# EasyEDA Pro project M484SID.eprj

# Schematic M484SID.LCSch
Create Date: 2023-01-18; Page Name: Core; Project Name: M484SID; Schematic Name: M484SID.LCSch; Update Date: 2023-08-13; Company: 嘉立创EDA; Page Size: A4; Version: V1.0
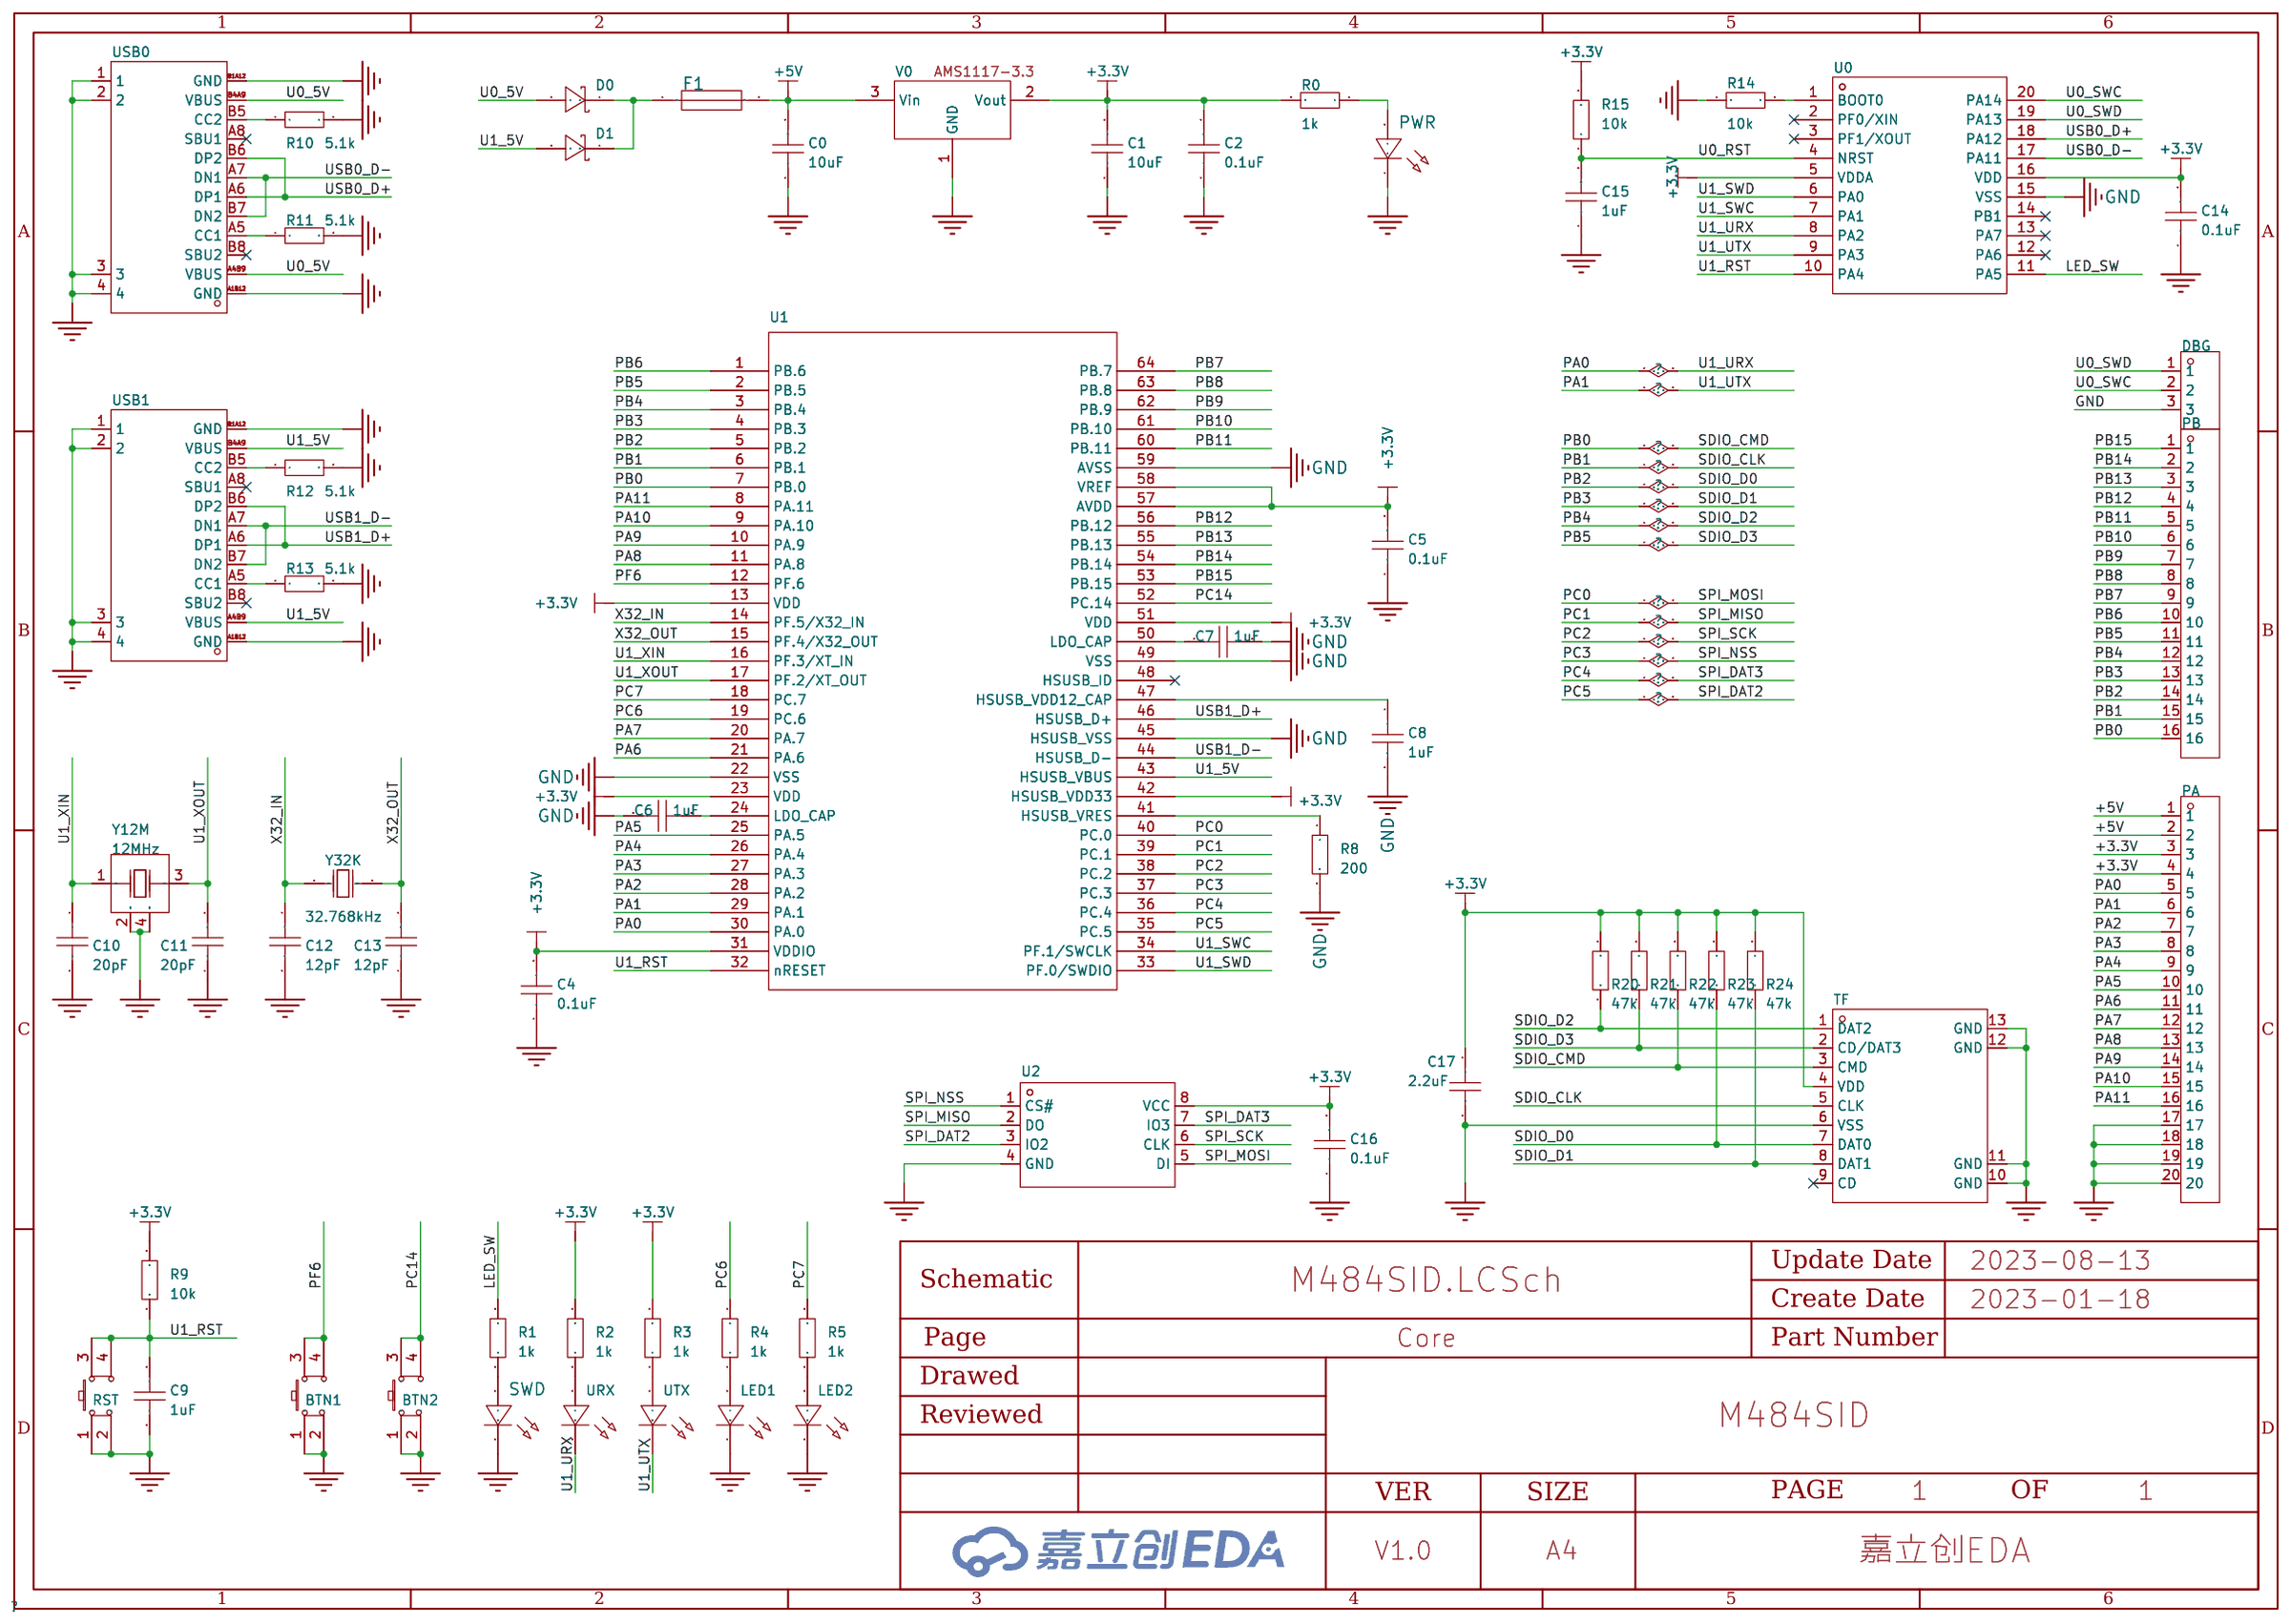
[diagram p0: schematic sheet]

## Parts
BTN1  PTS815SJK250SMTRLFS  [SW-SMD_4P-L4.2-W3.3-P2.15-LS5.1]
BTN2  PTS815SJK250SMTRLFS  [SW-SMD_4P-L4.2-W3.3-P2.15-LS5.1]
C0  10uF  [C0603]
C1  10uF  [C0603]
C2  0.1uF  [C0603]
C4  0.1uF  [C0603]
C5  0.1uF  [C0603]
C6  1uF  [C0603]
C7  1uF  [C0603]
C8  1uF  [C0603]
C9  1uF  [C0603]
C10  20pF  [C0603]
C11  20pF  [C0603]
C12  12pF  [C0603]
C13  12pF  [C0603]
C14  0.1uF  [C0603]
C15  1uF  [C0603]
C16  0.1uF  [C0603]
C17  2.2uF  [C0603]
D0  1N5818W  [SOD-123FL_L2.8-W1.8-LS3.7-RD]
D1  1N5818W  [SOD-123FL_L2.8-W1.8-LS3.7-RD]
DBG  -  [HDR-TH_3P-P2.54-V-M]
F1  JK-nSMD050-30  [F1206]
LED1  -  [LED0603-RD_BLUE]
LED2  -  [LED0603-RD_BLUE]
PA  -  [HDR-TH_20P-P2.54-V-M-1]
PB  -  [HDR-TH_16P-P2.54-V-M]
PWR  -  [LED0603-RD_BLUE]
R0  1k  [R0603]
R1  1k  [R0603]
R2  1k  [R0603]
R3  1k  [R0603]
R4  1k  [R0603]
R5  1k  [R0603]
R8  200  [R0603]
R9  10k  [R0603]
R10  5.1k  [R0603]
R11  5.1k  [R0603]
R12  5.1k  [R0603]
R13  5.1k  [R0603]
R14  10k  [R0603]
R15  10k  [R0603]
R20  47k  [R0603]
R21  47k  [R0603]
R22  47k  [R0603]
R23  47k  [R0603]
R24  47k  [R0603]
RST  PTS815SJK250SMTRLFS  [SW-SMD_4P-L4.2-W3.3-P2.15-LS5.1]
SWD  -  [LED0603-RD_BLUE]
TF  TF-01  [TF-SMD_TF-02]
U0  -  [TSSOP-20_L6.5-W4.4-P0.65-LS6.4-BL]
U1  *  [LQFP-64_7X7X04P]
U2  W25Q128JVSIQ  [SOIC-8_L5.3-W5.3-P1.27-LS8.0-BL]
URX  -  [LED0603-RD]
USB0  USB-TYPE-C-017  [USB-TYPE-C-SMD_C9900008089]
USB1  USB-TYPE-C-017  [USB-TYPE-C-SMD_C9900008089]
UTX  -  [LED0603-RD]
V0  AMS1117-3.3  [SOT-89-3_L4.5-W2.5-P1.50-LS4.2-BR]
Y12M  12MHz  [OSC-SMD_4P-L3.2-W2.5-BL]
Y32K  32.768kHz  [OSC-SMD_L3.2-W1.5]

## Library data of the parts
BTN1 BTN2 RST = PTS815SJK250SMTRLFS: 操作寿命10万次，使用温度-20°C 至 70°C,尺寸4.20mmx3.20mmx2.50mm，操作力度2.5N; LCSC Part Name: 轻触开关; Supplier Part: C918859; Manufacturer: C&K; Supplier Footprint: SMD; JLCPCB Part Class: 扩展库; Datasheet: https://atta.szlcsc.com/upload/public/pdf/source/20190916/C411883_4F77F16E1D8E48DC707D8949CEE7CF80.pdf; Supplier: LCSC
C0-C2 C4-C17 = CAP_0603: 容值:100nF;精度:±10%;额定电压:50V;温度系数:X7R;; Supplier Footprint: 0603
D0 D1 = 1N5818W: 二极管配置:独立式;直流反向耐压(Vr):30V;平均整流电流(Io):1A;正向压降(Vf):875mV@3A;反向电流(Ir):1mA@30V;; LCSC Part Name: 30V 1A 875mV@3A; Supplier Part: C437955; Manufacturer: 晶导微电子; Supplier Footprint: SOD-123FL; JLCPCB Part Class: 扩展库; Datasheet: https://atta.szlcsc.com/upload/public/pdf/source/20191021/C437955_D85247C8F9BBF53ADBACE43A150B0393.pdf; Supplier: LCSC; Diode Configuration: 独立式; Reverse Voltage (Vr): 30V; Average Rectified Current (Io): 1A; Forward Voltage (Vf@If): 875mV@3A; Reverse Leakage Current (Ir): 1mA@30V
DBG = HDR-M_2.54_1x3P: Supplier Part: C2937625; Supplier Footprint: 插件
F1 = JK-nSMD050-30: 最大电压:30V;最大电流:100A;保持电流:500mA;跳闸电流:1A;; LCSC Part Name: 30V 500mA 1206自恢复; Supplier Part: C720075; Manufacturer: JK(金科); Supplier Footprint: 1206; JLCPCB Part Class: 扩展库; Datasheet: https://atta.szlcsc.com/upload/public/pdf/source/20200810/C720075_06AF2D4541537091880CC35F0EFB49F8.pdf; Supplier: LCSC; Operating Voltage (Max): 30V; Current Rating (Max): 100A; Hold Current: 500mA; Trip Current: 1A; Power Dissipation: 600mW; Resistance - Initial (Ri) (Min): 150mΩ; Resistance - Post Trip (R1) (Max): 300mΩ; Maximum Time to Trip: 100ms; Operating Temperature: -40℃~+85℃
LED1 LED2 = LED_0603-B: 照明颜色:蓝色;主波长/色坐标:465~475nm;; Supplier Footprint: 0603; Supplier Part: C72041
PA = HDR-M_2.54_1x20P: 间距:2.54mm;总PIN位数:20;排数:1;插针结构:-;行距:-;安装类型:直插;圆针/方针:-;额定电流:-;额定电压:-;配合针长度:-;塑高:-;触头材质:黄铜;触头镀层:-;颜色:黑色;; Supplier Part: C50981; Supplier Footprint: 插件
PB = HDR-M_2.54_1x16P: 间距:2.54mm;总PIN位数:16;排数:1;插针结构:1x16P;行距:-;安装类型:直插;圆针/方针:方针;额定电流:3A;额定电压:-;配合针长度:6mm;塑高:2.5mm;端接针长度:3mm;触头材质:-;工作温度范围:-40~+105;颜色:黑色;; Supplier Part: C2894939; Supplier Footprint: 插件
PWR SWD = LED_0603-R: 发光颜色:红灯;二极管配置:-;透镜颜色:无色透明;主波长:617.5nm;峰值波长:632nm;色温:-;光通量(25时):-;测试电流:5mA;正向电压(VF):2.2V;发光强度:28.5mcd;功率:60mW;发光角度:120°;安装方式:-;工作温度:-40~+85;; Supplier Footprint: 0603; Supplier Part: C72044
R0-R5 R8-R15 R20-R24 = Res_0603: Supplier Footprint: 0603
TF = TF-01: 卡连接方式:自弹式;卡类型:MicroSD卡(TF卡);连接器类型:卡座;本体最大高度:2mm;工作温度范围:-;; LCSC Part Name: 自弹式 MicroSD卡(TF卡) 卡座 9P外焊 端子镀金; Supplier Part: C2889257; Manufacturer: Yuandi(台湾元迪); Supplier Footprint: SMD; JLCPCB Part Class: 扩展库; Datasheet: https://atta.szlcsc.com/upload/public/pdf/source/20210830/04E8B8B371F2BAAE2FD01F5A99E06D9E.pdf; Supplier: LCSC; Card Connection Mode: 自弹式; Card Type: MicroSD卡(TF卡); Connector Type: 卡座; Maximum Body Height: 2mm
U0 = AT32F425F8
U1 = M484SID: Comment: M482SID
U2 = W25Q128JVSIQ: 存储器构架(格式):FLASH;存储器接口类型:SPI - Dual/Quad I/O;存储器容量:128Mb (16M x 8);; Supplier Part: C97521; Manufacturer: WINBOND(华邦); Supplier Footprint: SOIC-8_208mil; JLCPCB Part Class: 基础库; Datasheet: https://atta.szlcsc.com/upload/public/pdf/source/20170316/1489627409956.pdf; Supplier: LCSC; Memory Format: FLASH; Memory Interface: SPI - Dual/Quad I/O; Memory Size: 128Mb (16M x 8); Voltage - Supply: 2.7V ~ 3.6V
URX UTX = LED_0603-G: 照明颜色:翠绿;色温 - CCT（K）:-;主波长/色坐标:520~535nm;; Supplier Footprint: 0603; Supplier Part: C72043
USB0 USB1 = USB-TYPE-C-017: 连接器类型:Type-C;标准:-;公母:母座;触点数量:16;端口数量:1;安装方式:卧贴;额定电流 - 电源:3A;工作温度范围:-25~+85;; Supplier Part: C2927037; Manufacturer: DEALON(德艺隆); Supplier Footprint: SMD; JLCPCB Part Class: 扩展库; Datasheet: https://atta.szlcsc.com/upload/public/pdf/source/20211217/653222EE5174722C9DFE2966329956D8.pdf; Supplier: LCSC; Connector Type: Type-C; Gender: 母座; Number of Contacts: 16; Number of Ports: 1; Mounting Style: 卧贴; Current Rating - Power (Max): 3A; Operating Temperature Range: -25~+85
V0 = AMS1117-3.3_SOT-89: 输出类型:-;; Supplier Part: C880752; Manufacturer: Slkor(萨科微); Supplier Footprint: SOT-89-3; JLCPCB Part Class: 扩展库; Datasheet: https://atta.szlcsc.com/upload/public/pdf/source/20201231/C426566_7F22DB93439D00F3FA27143E4F28C6AA.pdf; Supplier: LCSC
Y12M = X322512MSB4SI: 晶振类型:贴片无源晶振;频率:12MHz;频率公差:±10ppm;频率稳定度:±30ppm;负载电容:20pF;工作温度:-40~+85;; LCSC Part Name: 12MHz ±10ppm 20pF; Supplier Part: C9002; Manufacturer: YXC(扬兴晶振); Supplier Footprint: SMD3225-4P; JLCPCB Part Class: 基础库; Datasheet: https://atta.szlcsc.com/upload/public/pdf/source/20210329/C112971_1F611BDC486E193C1706F6D8EB5AA189.pdf; Supplier: LCSC; Crystal Type: 贴片无源晶振; Frequency Tolerance: ±10ppm; Frequency Stability: ±30ppm; Load Capacitance: 20pF; Operating Temperature: -40~+85
Y32K = 7LC32768F12UC: 工作温度:-40~+85;工作温度:-40~+85;频率:32.768kHz;负载电容:12.5pF;晶振类型:贴片无源晶振;频率公差:±20ppm;频率公差:±20ppm;等效串联电阻(ESR):70kΩ;; LCSC Part Name: 32.768KHZ 12.5PF  ±20ppm; Supplier Part: C252398; Manufacturer: SJK(晶科鑫); Supplier Footprint: SMD-3215_2P; JLCPCB Part Class: 扩展库; Datasheet: https://atta.szlcsc.com/upload/public/pdf/source/20180725/C252398_B09721EBC402D2F46F4FCA4EBDD60A31.pdf; Supplier: LCSC; Operating Temperature: -40~+85; Load Capacitance: 12.5pF; Crystal Type: 贴片无源晶振; Frequency Tolerance: ±20ppm; Equivalent Series Resistance (ESR): 70kΩ

## Nets
+3.3V: C1.2 C2.2 C4.2 C5.2 C14.2 C16.2 C17.1 PA.3 PA.4 R0.2 R2.2 R3.2 R9.2 R15.2 R20.2 R21.2 R22.2 R23.2 R24.2 TF.4(VDD) U0.5(VDDA) U0.16(VDD) U1.13(VDD) U1.23(VDD) U1.31(VDDIO) U1.42(HSUSB_VDD33) U1.51(VDD) U1.57(AVDD) U1.58(VREF) U2.8(VCC) V0.2(Vout)
+5V: C0.2 F1.2 PA.1 PA.2 V0.3(Vin)
GND: BTN1.1 BTN1.2 BTN2.1 BTN2.2 C0.1 C1.1 C2.1 C4.1 C5.1 C6.2 C7.2 C8.2 C9.1 C10.2 C11.1 C12.2 C13.1 C14.1 C15.1 C16.1 C17.2 DBG.3 LED1.1(C) LED2.1(C) PA.17 PA.18 PA.19 PA.20 PWR.1(C) R8.2 R10.2 R11.2 R12.2 R13.2 R14.1 RST.1 RST.2 SWD.1(C) TF.6(VSS) TF.10(GND) TF.11(GND) TF.12(GND) TF.13(GND) U0.15(VSS) U1.22(VSS) U1.45(HSUSB_VSS) U1.49(VSS) U1.59(AVSS) U2.4(GND) USB0.1 USB0.2 USB0.3 USB0.4 USB0.A1B12(GND) USB0.B1A12(GND) USB1.1 USB1.2 USB1.3 USB1.4 USB1.A1B12(GND) USB1.B1A12(GND) V0.1(GND) Y12M.2(GND) Y12M.4(GND)
LED_SW: R1.2 U0.11(PA5)
PA0: PA.5 U0.8(PA2) U1.30(PA.0) URX.1(C)
PA1: PA.6 U0.9(PA3) U1.29(PA.1) UTX.1(C)
PA2: PA.7 U1.28(PA.2)
PA3: PA.8 U1.27(PA.3)
PA4: PA.9 U1.26(PA.4)
PA5: PA.10 U1.25(PA.5)
PA6: PA.11 U1.21(PA.6)
PA7: PA.12 U1.20(PA.7)
PA8: PA.13 U1.11(PA.8)
PA9: PA.14 U1.10(PA.9)
PA10: PA.15 U1.9(PA.10)
PA11: PA.16 U1.8(PA.11)
PB0: PB.16 R22.1 TF.3(CMD) U1.7(PB.0)
PB1: PB.15 TF.5(CLK) U1.6(PB.1)
PB2: PB.14 R23.1 TF.7(DAT0) U1.5(PB.2)
PB3: PB.13 R24.1 TF.8(DAT1) U1.4(PB.3)
PB4: PB.12 R20.1 TF.1(DAT2) U1.3(PB.4)
PB5: PB.11 R21.1 TF.2(CD/DAT3) U1.2(PB.5)
PB6: PB.10 U1.1(PB.6)
PB7: PB.9 U1.64(PB.7)
PB8: PB.8 U1.63(PB.8)
PB9: PB.7 U1.62(PB.9)
PB10: PB.6 U1.61(PB.10)
PB11: PB.5 U1.60(PB.11)
PB12: PB.4 U1.56(PB.12)
PB13: PB.3 U1.55(PB.13)
PB14: PB.2 U1.54(PB.14)
PB15: PB.1 U1.53(PB.15)
PC0: U1.40(PC.0) U2.5(DI)
PC1: U1.39(PC.1) U2.2(DO)
PC2: U1.38(PC.2) U2.6(CLK)
PC3: U1.37(PC.3) U2.1(CS#)
PC4: U1.36(PC.4) U2.7(IO3)
PC5: U1.35(PC.5) U2.3(IO2)
PC6: R4.2 U1.19(PC.6)
PC7: R5.2 U1.18(PC.7)
PC14: BTN2.3 BTN2.4 U1.52(PC.14)
PF6: BTN1.3 BTN1.4 U1.12(PF.6)
U0_5V: D0.2(A) USB0.A4B9(VBUS) USB0.B4A9(VBUS)
U0_RST: C15.2 R15.1 U0.4(NRST)
U0_SWC: DBG.2 U0.20(PA14)
U0_SWD: DBG.1 U0.19(PA13)
U1_5V: D1.2(A) U1.43(HSUSB_VBUS) USB1.A4B9(VBUS) USB1.B4A9(VBUS)
U1_RST: C9.2 R9.1 RST.3 RST.4 U0.10(PA4) U1.32(nRESET)
U1_SWC: U0.7(PA1) U1.34(PF.1/SWCLK)
U1_SWD: U0.6(PA0) U1.33(PF.0/SWDIO)
U1_XIN: C10.1 U1.16(PF.3/XT_IN) Y12M.1(OSC1)
U1_XOUT: C11.2 U1.17(PF.2/XT_OUT) Y12M.3(OSC2)
USB0_D+: U0.18(PA12) USB0.A6(DP1) USB0.B6(DP2)
USB0_D-: U0.17(PA11) USB0.A7(DN1) USB0.B7(DN2)
USB1_D+: U1.46(HSUSB_D+) USB1.A6(DP1) USB1.B6(DP2)
USB1_D-: U1.44(HSUSB_D-) USB1.A7(DN1) USB1.B7(DN2)
X32_IN: C12.1 U1.14(PF.5/X32_IN) Y32K.1(OSC1)
X32_OUT: C13.2 U1.15(PF.4/X32_OUT) Y32K.2(OSC2)
$1N5592: R11.1 USB0.A5(CC1)
$1N5593: R10.1 USB0.B5(CC2)
$1N5603: PWR.2(A) R0.1
$1N5607: R13.1 USB1.A5(CC1)
$1N5608: R12.1 USB1.B5(CC2)
$1N5816: R14.2 U0.1(BOOT0)
$1N15618: C7.1 U1.50(LDO_CAP)
$1N16226: C6.1 U1.24(LDO_CAP)
$1N17258: R2.1 URX.2(A)
$1N17260: R1.1 SWD.2(A)
$1N17262: R3.1 UTX.2(A)
$1N17268: LED1.2(A) R4.1
$1N17271: LED2.2(A) R5.1
$1N30043: C8.1 U1.47(HSUSB_VDD12_CAP)
$1N30366: R8.1 U1.41(HSUSB_VRES)
$1N62267: D0.1(C) D1.1(C) F1.1

Not connected (* = marked no-connect by the designer): TF 9(CD)*; U0 2(PF0/XIN)* 3(PF1/XOUT)* 12(PA6)* 13(PA7)* 14(PB1)*; U1 48(HSUSB_ID)*; USB0 A8(SBU1)* B8(SBU2)*; USB1 A8(SBU1)* B8(SBU2)*

# Board M484SID.LCPcb
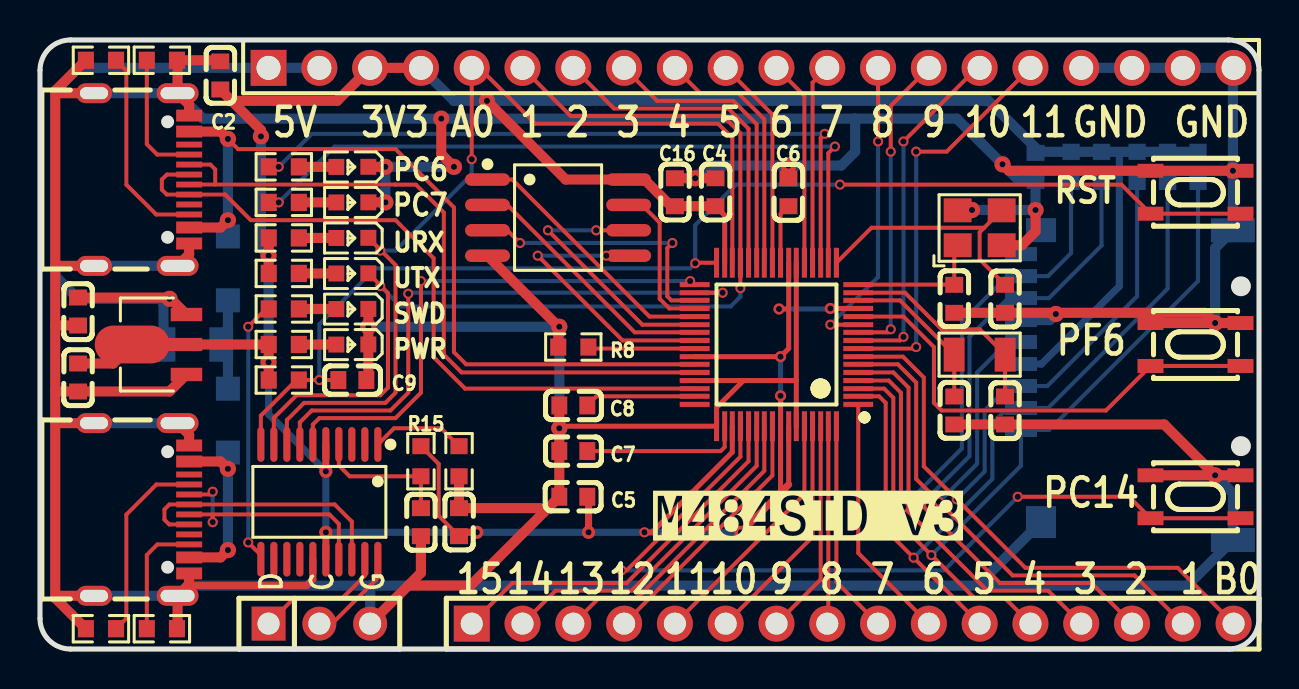
[diagram p1: board, top side]
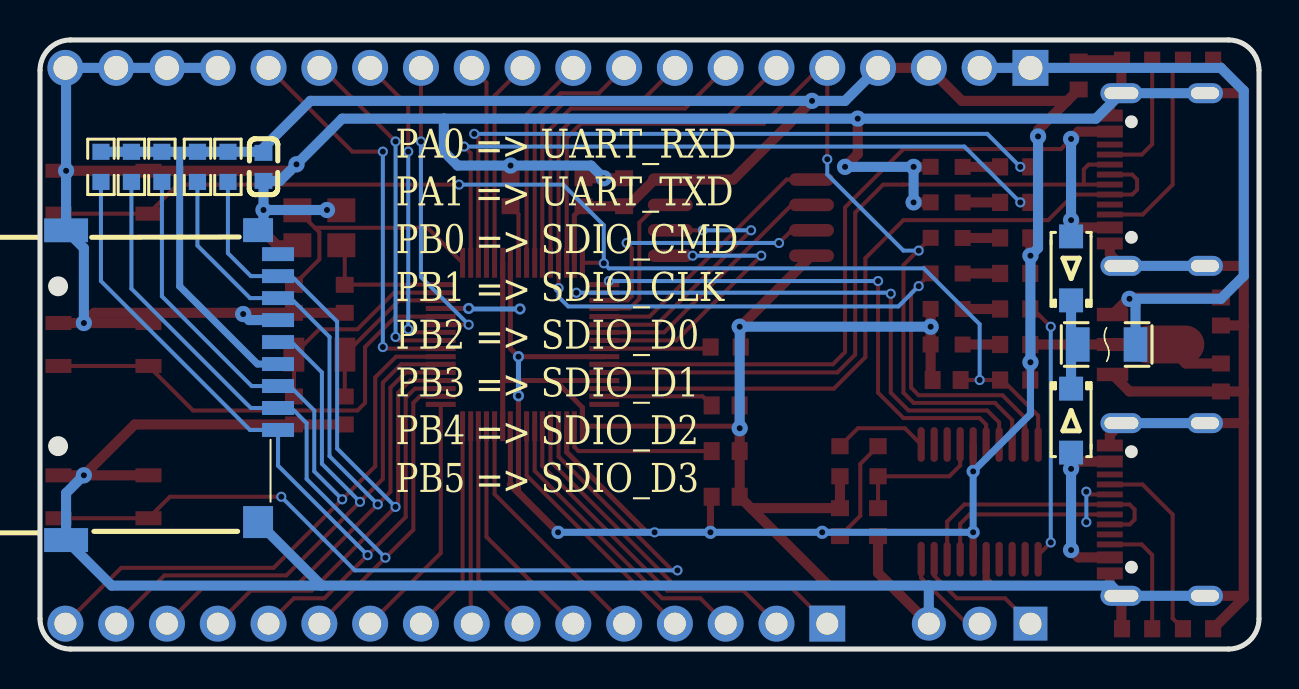
[diagram p2: board, bottom side, seen from below]

Outline 60.96 x 30.48 mm; copper layers: Top Layer, Bottom Layer. Coordinates in mm from the lower left corner of the outline.
Outline path: 0,28.96 0,1.52 arc(0.45,0.45) 1.52,0 59.44,0 arc(60.51,0.45) 60.96,1.52 60.96,28.96 arc(60.51,30.03) 59.44,30.48 1.52,30.48 arc(0.45,30.03) 0,28.96
Stack: Top Layer 0.035mm / Dielectric1 1.51mm FR4 er 4.5 / Bottom Layer 0.035mm

## Design rules (mm)
net USB1_D+: USB1
net USB1_D-: USB1
spacing safeClearance (default): track to track 0.127, other pairs 0.127 to 0.254
track width trackWidth (default): min 0.127, default 0.254, max 2.54
differential pair differentialPair (default): width min 0.127, default 0.254, max 2.54; gap min 0.152, default 0.152
via viaSize (default): diameter min 0.5, default 0.61, max 10; hole min 0.3, default 0.305, max 6

## Placement (name value [footprint] x y rotation side)
BTN1  PTS815SJK250SMTRLFS  [SW-SMD_4P-L4.2-W3.3-P2.15-LS5.1]  57.78 15.24 0 top
BTN2  PTS815SJK250SMTRLFS  [SW-SMD_4P-L4.2-W3.3-P2.15-LS5.1]  57.78 7.62 0 top
C0  10uF  [C0603]  1.91 16.89 90 top
C1  10uF  [C0603]  1.91 13.59 90 top
C2  0.1uF  [C0603]  9.02 28.7 270 top
C4  0.1uF  [C0603]  33.78 22.86 270 top
C5  0.1uF  [C0603]  26.67 7.62 0 top
C6  1uF  [C0603]  37.43 22.86 90 top
C7  1uF  [C0603]  26.67 9.91 180 top
C8  1uF  [C0603]  26.67 12.19 180 top
C9  1uF  [C0603]  15.62 13.46 180 top
C10  20pF  [C0603]  45.72 17.53 270 top
C11  20pF  [C0603]  48.26 17.53 90 top
C12  12pF  [C0603]  45.72 11.94 270 top
C13  12pF  [C0603]  48.26 11.94 90 top
C14  0.1uF  [C0603]  20.96 6.35 270 top
C15  1uF  [C0603]  19.05 6.35 90 top
C16  0.1uF  [C0603]  31.75 22.86 270 top
C17  2.2uF  [C0603]  49.78 24.13 270 bottom
D0  1N5818W  [SOD-123FL_L2.8-W1.8-LS3.7-RD]  9.4 11.43 270 bottom
D1  1N5818W  [SOD-123FL_L2.8-W1.8-LS3.7-RD]  9.4 19.05 90 bottom
DBG  -  [HDR-TH_3P-P2.54-V-M]  13.97 1.27 0 top
F1  JK-nSMD050-30  [F1206]  7.62 15.24 180 bottom
LED1  -  [LED0603-RD_BLUE]  15.62 24.13 180 top
LED2  -  [LED0603-RD_BLUE]  15.62 22.35 180 top
PA  -  [HDR-TH_20P-P2.54-V-M-1]  35.56 29.08 0 top
PB  -  [HDR-TH_16P-P2.54-V-M]  40.64 1.27 0 top
PWR  -  [LED0603-RD_BLUE]  15.62 15.24 180 top
R0  1k  [R0603]  12.19 15.24 180 top
R1  1k  [R0603]  12.19 17.02 180 top
R2  1k  [R0603]  12.19 20.57 180 top
R3  1k  [R0603]  12.19 18.8 180 top
R4  1k  [R0603]  12.19 24.13 180 top
R5  1k  [R0603]  12.19 22.35 180 top
R8  200  [R0603]  26.67 15.11 180 top
R9  10k  [R0603]  12.19 13.46 180 top
R10  5.1k  [R0603]  6.1 1.02 0 top
R11  5.1k  [R0603]  3.05 1.02 180 top
R12  5.1k  [R0603]  3.05 29.46 180 top
R13  5.1k  [R0603]  6.1 29.46 0 top
R14  10k  [R0603]  20.96 9.4 90 top
R15  10k  [R0603]  19.05 9.4 90 top
R20  47k  [R0603]  57.91 24.13 90 bottom
R21  47k  [R0603]  56.39 24.13 90 bottom
R22  47k  [R0603]  54.86 24.13 90 bottom
R23  47k  [R0603]  53.09 24.13 90 bottom
R24  47k  [R0603]  51.56 24.13 90 bottom
RST  PTS815SJK250SMTRLFS  [SW-SMD_4P-L4.2-W3.3-P2.15-LS5.1]  57.78 22.86 0 top
SWD  -  [LED0603-RD_BLUE]  15.62 17.02 180 top
TF  TF-01  [TF-SMD_TF-02]  54.36 13.21 270 bottom
U0  -  [TSSOP-20_L6.5-W4.4-P0.65-LS6.4-BL]  13.97 7.37 180 top
U1  *  [LQFP-64_7X7X04P]  36.83 15.24 90 top
U2  W25Q128JVSIQ  [SOIC-8_L5.3-W5.3-P1.27-LS8.0-BL]  25.91 21.59 270 top
URX  -  [LED0603-RD]  15.62 20.57 180 top
USB0  USB-TYPE-C-017  [USB-TYPE-C-SMD_C9900008089]  5.08 6.98 270 top
USB1  USB-TYPE-C-017  [USB-TYPE-C-SMD_C9900008089]  5.08 23.5 270 top
UTX  -  [LED0603-RD]  15.62 18.8 180 top
V0  AMS1117-3.3  [SOT-89-3_L4.5-W2.5-P1.50-LS4.2-BR]  5.97 15.24 0 top
Y12M  12MHz  [OSC-SMD_4P-L3.2-W2.5-BL]  46.99 21.08 0 top
Y32K  32.768kHz  [OSC-SMD_L3.2-W1.5]  46.99 14.73 0 top

## Footprints (pads in the part's own frame, mm; a bottom-side part is the same pattern mirrored in y, then rotated)
C0603
  rect 0.8x0.9 smd: 1(-0.7,0) 2(0.7,0)
F1206
  rect 1.19x1.728 smd: 1(-1.445,0) 2(1.445,0)
HDR-TH_3P-P2.54-V-M
  rect 1.7x1.7 hole 1.1: 1(-2.54,0)
  round 1.7 hole 1.1: 2(0,0) 3(2.54,0)
HDR-TH_16P-P2.54-V-M
  rect 1.801x1.801 hole 1.1: 1(-19.05,0)
  round 1.801 hole 1.1: 2(-16.51,0) 3(-13.97,0) 4(-11.43,0) 5(-8.89,0) 6(-6.35,0) 7(-3.81,0) 8(-1.27,0) 9(1.27,0) 10(3.81,0) 11(6.35,0) 12(8.89,0) 13(11.43,0) 14(13.97,0) 15(16.51,0) 16(19.05,0)
HDR-TH_20P-P2.54-V-M-1
  rect 1.801x1.801 hole 1.199: 1(-24.13,0)
  round 1.801 hole 1.199: 2(-21.59,0) 3(-19.05,0) 4(-16.51,0) 5(-13.97,0) 6(-11.43,0) 7(-8.89,0) 8(-6.35,0) 9(-3.81,0) 10(-1.27,0) 11(1.27,0) 12(3.81,0) 13(6.35,0) 14(8.89,0) 15(11.43,0) 16(13.97,0) 17(16.51,0) 18(19.05,0) 19(21.59,0) 20(24.13,0)
LED0603-RD
  rect 0.8x0.8 smd: 1(-0.799,-0.004) 2(0.799,0.004)
LED0603-RD_BLUE
  rect 0.8x0.8 smd: 1(-0.8,-0.003) 2(0.8,0.003)
LQFP-64_7X7X04P
  rect 0.254x1.498 smd: 1(-2.997,-4.09) 2(-2.591,-4.09) 3(-2.21,-4.09) 4(-1.804,-4.09) 5(-1.397,-4.09) 6(-0.991,-4.09) 7(-0.61,-4.09) 8(-0.203,-4.09) 9(0.203,-4.09) 10(0.61,-4.09) 11(0.991,-4.09) 12(1.397,-4.09) 13(1.804,-4.09) 14(2.21,-4.09) 15(2.591,-4.09) 16(2.997,-4.09) 33(2.997,4.09) 34(2.591,4.09) 35(2.21,4.09) 36(1.804,4.09) 37(1.397,4.09) 38(0.991,4.09) 39(0.61,4.09) 40(0.203,4.09) 41(-0.203,4.09) 42(-0.61,4.09) 43(-0.991,4.09) 44(-1.397,4.09) 45(-1.804,4.09) 46(-2.21,4.09) 47(-2.591,4.09) 48(-2.997,4.09)
  rect 1.498x0.254 smd: 17(4.09,-2.997) 18(4.09,-2.591) 19(4.09,-2.21) 20(4.09,-1.804) 21(4.09,-1.397) 22(4.09,-0.991) 23(4.09,-0.61) 24(4.09,-0.203) 25(4.09,0.203) 26(4.09,0.61) 27(4.09,0.991) 28(4.09,1.397) 29(4.09,1.804) 30(4.09,2.21) 31(4.09,2.591) 32(4.09,2.997) 49(-4.09,2.997) 50(-4.09,2.591) 51(-4.09,2.21) 52(-4.09,1.804) 53(-4.09,1.397) 54(-4.09,0.991) 55(-4.09,0.61) 56(-4.09,0.203) 57(-4.09,-0.203) 58(-4.09,-0.61) 59(-4.09,-0.991) 60(-4.09,-1.397) 61(-4.09,-1.804) 62(-4.09,-2.21) 63(-4.09,-2.591) 64(-4.09,-2.997)
OSC-SMD_4P-L3.2-W2.5-BL
  rect 1.4x1.2 smd: 1(-1.1,-0.875) 2(1.1,-0.875) 3(1.1,0.875) 4(-1.1,0.875)
OSC-SMD_L3.2-W1.5
  rect 1.049x1.7 smd: 1(-1.275,0) 2(1.275,0)
R0603
  rect 0.806x0.864 smd: 1(-0.753,0) 2(0.753,0)
SOD-123FL_L2.8-W1.8-LS3.7-RD
  rect 1.2x1.2 smd: 1(-1.6,0) 2(1.6,0)
SOIC-8_L5.3-W5.3-P1.27-LS8.0-BL
  oval 0.63x2.25 smd: 1(-1.905,-3.53) 2(-0.635,-3.53) 3(0.635,-3.53) 4(1.905,-3.53) 5(1.905,3.53) 6(0.635,3.53) 7(-0.635,3.53) 8(-1.905,3.53)
SOT-89-3_L4.5-W2.5-P1.50-LS4.2-BR
  rect 1.575x0.672 smd: 1(1.356,-1.5) 3(1.356,1.5)
  custom 5.377x1.9 smd: 2(-1.356,0)
SW-SMD_4P-L4.2-W3.3-P2.15-LS5.1
  rect 1.3x0.701 smd: 1(-2.251,1.075) 2(2.251,1.075) 3(-2.251,-1.075) 4(2.251,-1.075)
TF-SMD_TF-02
  rect 0.7x1.6 smd: 1(2.245,5.3) 2(1.145,5.3) 3(0.046,5.3) 4(-1.054,5.3) 5(-2.155,5.3) 6(-3.255,5.3) 7(-4.354,5.3) 8(-5.454,5.3) 9(-6.554,5.3)
  rect 1.2x1.5 smd: 10(-7.754,4.3)
  rect 1.2x2.2 smd: 11(-7.746,-5.3) 12(7.754,-5.3)
  rect 1.6x1.5 smd: 13(6.854,4.3)
TSSOP-20_L6.5-W4.4-P0.65-LS6.4-BL
  oval 0.364x1.742 smd: 1(-2.925,-2.871) 2(-2.275,-2.871) 3(-1.625,-2.871) 4(-0.975,-2.871) 5(-0.325,-2.871) 6(0.325,-2.871) 7(0.975,-2.871) 8(1.625,-2.871) 9(2.275,-2.871) 10(2.925,-2.871) 11(2.925,2.871) 12(2.275,2.871) 13(1.625,2.871) 14(0.975,2.871) 15(0.325,2.871) 16(-0.325,2.871) 17(-0.975,2.871) 18(-1.625,2.871) 19(-2.275,2.871) 20(-2.925,2.871)
USB-TYPE-C-SMD_C9900008089
  oval 1x2.1 hole 0.6x1.7: 1(-4.32,1.801) 2(4.32,1.801)
  oval 1x1.8 hole 0.6x1.4: 3(-4.32,-2.379) 4(4.32,-2.379)
  rect 0.6x1.3 smd: A1B12(-3.2,2.379) A4B9(-2.4,2.379) B1A12(3.2,2.379) B4A9(2.4,2.379)
  rect 0.3x1.3 smd: A5(-1.25,2.379) A6(-0.25,2.379) A7(0.25,2.379) A8(1.25,2.379) B5(1.75,2.379) B6(0.75,2.379) B7(-0.75,2.379) B8(-1.75,2.379)

## Nets
As in the schematic.

Pads without a net: TF 9; U0 2 3 12 13 14; U1 48; USB0 A8 B8; USB1 A8 B8

## Via types
v1: diameter 0.813, hole 0.305, Top Layer to Bottom Layer, 25 vias
v2: diameter 0.508, hole 0.305, Top Layer to Bottom Layer, 42 vias
v3: diameter 0.559, hole 0.305, Top Layer to Bottom Layer, 4 vias
v4: diameter 0.66, hole 0.305, Top Layer to Bottom Layer, 5 vias

## Routing (per net, layer and track width the routed paths; a pad name or vN(x,y) marks a point on that pad's centre or on a via; arc(x,y) is an arc through that point)
+3.3V: length 184.1
  Top Layer w0.203: C14.2 19.94,6.67 19.94,9.26 R15.2
  Top Layer w0.254: U1.51 34.62,9.86 30.61,5.84 v2(30.23,5.84) ; C4.2 34.24,21.7 U1.31 ; v3(36.96,17.02) 37.44,17.02 ; U1.42 v3(37.03,14.63) 37.44,15.04 U1.23 ; U1.58 37.44,8.23 ; 37.03,7.82 v3(37.03,12.67) ; v3(39.52,17.04) U1.13
  Top Layer w0.355: U0.16 v4(14.29,5.84) ; v4(27.43,5.84) 27.43,7.56 C5.2 ; U0.5 v4(14.29,8.89) ; v4(35.05,5.84) 37.44,8.23 ; v4(21.84,5.84) 21.15,5.84 C14.2
  Top Layer w0.508: 9.59,27.43 C2.2 ; 9.59,27.43 11.05,25.97 v1(11.05,25.65) ; 9.59,27.43 14.86,27.43 PA.3 PA.4 ; C1.2 3.66,14.29 V0.2 R0.2 R9.2 ; v1(22.35,27.43) 26.29,23.5 U2.8 30.23,23.5 31.56,22.16 C16.2 C4.2 ; R2.2 R3.2
  Bottom Layer w0.254: v3(36.96,17.02) 39.5,17.02 v3(39.52,17.04) ; v3(37.03,14.63) v3(37.03,12.67)
  Bottom Layer w0.355: v4(35.05,5.84) v2(30.23,5.84) v4(27.43,5.84) v4(21.84,5.84) v4(14.29,5.84) v4(14.29,8.89) 11.43,11.75 v1(11.43,14.35) ; TF.4 50.08,14.26 53.97,18.15 53.97,24.88
  Bottom Layer w0.508: v1(11.05,25.65) 11.05,20.07 v1(11.43,19.69) v1(11.43,14.35) ; R20.2 R21.2 R22.2 R23.2 R24.2 49.98,24.88 47.44,27.43 v1(22.35,27.43) 20.7,27.43 PA.4
+5V: length 37.4
  Top Layer w0.508: 6.48,17.59 6.47,17.59 C0.2 ; 6.48,17.59 V0.3 ; 6.48,17.59 v1(6.48,17.53)
  Bottom Layer w0.508: PA.2 PA.1 1.91,29.08 0.76,27.94 0.76,18.67 1.91,17.53 v1(6.48,17.53) 6.17,17.22 F1.2
GND: length 365
  Top Layer w0.254: 35.18,13.44 37.82,13.44 ; 35.18,13.44 33.83,12.09 33.83,11.15 26.07,11.15 v1(25.97,11.05) ; 35.18,13.44 U1.45 ; U1.22 U1.59
  Top Layer w0.355: 7.46,3.24 7.53,3.17 13.34,3.17 13.65,3.48 U0.15
  Top Layer w0.508: v1(58.77,8.69) BTN2.2 ; v1(58.77,8.69) BTN2.1 ; v1(58.77,8.69) 56.22,11.24 C13.1 C12.2 ; R14.1 C14.1 25.4,7.05 ; v1(59.65,23.93) RST.1 48.46,23.93 v1(48.13,24.26) ; 18.41,3.17 21.53,3.17 25.4,7.05 ; 18.41,3.17 19.05,3.81 C15.1 ; 18.41,3.17 DBG.3 ; v1(50.8,16.76) 50.82,16.78 50.82,16.83 ; C8.2 v1(25.97,11.05) C7.2 C5.1 25.4,7.05 ; 0.76,27.93 0.88,27.81 USB1.3 ; 0.76,27.93 R12.2 ; 0.76,27.93 0.76,16.19 ; USB1.B1A12 7.46,19.75 USB1.2 ; USB0.3 0.76,11.31 ; R8.2 25.92,16.15 U2.4 ; C9.1 16.42,13.56 16.42,17.02 ; v1(20.07,26.54) 20.07,24.77 v1(20.7,24.13) ; C0.1 1.9,16.19 0.76,16.19 ; 0.76,12.89 6.48,12.89 V0.1 ; 0.76,12.89 0.76,16.19 ; 0.76,12.89 0.76,2.55 ; 50.82,16.83 58.25,16.83 v1(58.77,16.31) ; 50.82,16.83 C11.1 C10.2 ; C4.1 v1(32.77,23.56) C16.1 ; C6.2 v1(37.43,24.19) ; v1(58.77,16.31) BTN1.2 ; v1(58.77,16.31) BTN1.1 ; v1(17.27,24.13) 16.42,24.13 16.42,24.13 ; 16.42,22.35 17.27,22.35 v1(17.27,22.35) ; Y12M.2 49.09,20.21 49.78,20.9 v1(49.78,21.97) ; C2.1 8.96,29.46 R13.2 6.88,29.43 USB1.1 7.46,27.24 USB1.A1B12 ; R10.2 6.88,1.05 USB0.2 7.46,3.24 USB0.B1A12 ; USB0.1 7.46,10.73 USB0.A1B12 ; 0.76,2.55 0.88,2.67 USB0.4 ; 0.76,2.55 R11.2 ; USB1.4 0.76,19.17
  Bottom Layer w0.508: 40.76,26.54 40.77,26.54 40.77,24.89 40.07,24.19 v1(37.43,24.19) 33.4,24.19 v1(32.77,23.56) ; 40.76,26.54 v1(20.07,26.54) 8.15,26.54 USB1.1 USB1.3 ; 40.76,26.54 45.85,26.54 v1(48.13,24.26) 48.96,23.43 C17.2 v1(49.78,21.97) ; TF.6 50.5,16.46 v1(50.8,16.76) ; v1(58.77,8.69) 59.66,7.8 TF.12 57.38,3.17 46.88,3.17 ; v1(49.78,21.97) v1(46.61,21.97) ; v1(49.78,21.97) 49.78,21.23 TF.10 ; USB0.4 USB0.2 7.39,3.17 16.51,3.17 ; USB1.4 USB1.2 ; v1(17.27,22.35) v1(17.27,24.13) v1(20.7,24.13) ; 46.88,3.17 16.51,3.17 ; 46.88,3.17 TF.13 ; DBG.3 16.51,1.27 16.51,3.17 ; USB0.3 USB0.1 ; v1(25.97,11.05) 25.97,16.13 ; v1(16.42,16.13) v1(25.97,16.13) ; v1(58.77,16.31) 58.77,20.06 TF.11 59.66,29.05 PA.20 PA.19 PA.18 PA.17
LED_SW: length 13.3
  Top Layer w0.203: R1.2 11.3,17.02 v2(10.41,16.13) ; U0.11 11.04,4.7 v2(10.41,5.33)
  Bottom Layer w0.203: v2(10.41,5.33) v2(10.41,16.13)
PA0: length 47.8
  Top Layer w0.203: v2(17.02,19.94) 17.04,19.96 ; 17.04,19.96 URX.1 ; 17.04,19.96 17.78,19.22 17.78,12.83 17.27,12.32 13.21,12.32 12.34,11.46 U0.8 ; U1.30 34.62,25.58 33.91,26.29 24.76,26.29 21.97,29.08 PA.5 v2(21.59,24.51)
  Bottom Layer w0.203: v2(21.59,24.51) 21.59,23.75 17.78,19.94 v2(17.02,19.94)
PA1: length 52.9
  Top Layer w0.203: PA.6 26.54,26.67 34.16,26.67 35.03,25.81 U1.29 v2(35.03,18.06) ; UTX.1 17.09,18.13 ; 17.09,18.13 17.05,18.13 v2(17.02,18.16) ; 17.09,18.13 17.4,17.82 17.4,13.08 17.02,12.7 12.83,12.7 11.69,11.57 U0.9
  Bottom Layer w0.203: v2(17.02,18.16) 18.03,17.14 34.54,17.14 35.03,17.63 v2(35.03,18.06)
PA2: length 16.7
  Top Layer w0.203: 35.43,19.33 35.43,26.03 34.42,27.05 28.7,27.05 PA.7
PA3: length 14.7
  Top Layer w0.203: U1.27 35.84,26.26 34.67,27.43 30.86,27.43 PA.8
PA4: length 12.7
  Top Layer w0.203: PA.9 33.02,27.81 34.93,27.81 36.22,26.52 U1.26
PA5: length 10.7
  Top Layer w0.203: U1.25 36.63,26.75 PA.10
PA6: length 10.3
  Top Layer w0.203: U1.21 38.23,27.69 PA.11
PA7: length 10.1
  Top Layer w0.203: PA.12 38.63,28.35 U1.20
PA8: length 15.2
  Top Layer w0.203: v2(41.91,25.4) PA.13 ; v2(39.52,16.23) U1.11
  Bottom Layer w0.203: v2(39.52,16.23) 41.91,18.62 v2(41.91,25.4)
PA9: length 15.6
  Top Layer w0.203: U1.10 42.39,15.85 v2(42.54,16) ; v2(42.54,24.89) 42.54,27.18 PA.14
  Bottom Layer w0.203: v2(42.54,16) v2(42.54,24.89)
PA10: length 17.4
  Top Layer w0.203: v2(43.18,15.62) 43,15.44 U1.9 ; PA.15 46.86,29.08 v2(43.18,25.4)
  Bottom Layer w0.203: v2(43.18,15.62) v2(43.18,25.4)
PA11: length 20.2
  Top Layer w0.203: v2(43.81,15.11) 43.74,15.04 U1.8 ; v2(43.81,24.89) 45.34,24.89 PA.16
  Bottom Layer w0.203: v2(43.81,15.11) v2(43.81,24.89)
PB0: length 47.6
  Top Layer w0.203: PB.16 56.9,4.06 49.28,4.06 v2(45.85,7.49) 44.2,9.14 44.2,13.59 43.15,14.63 U1.7
  Bottom Layer w0.203: v2(45.85,7.49) 47.24,8.89 47.24,11.94 48.47,13.16 TF.3 50.37,13.16 54.86,17.65 R22.1
PB1: length 34.5
  Top Layer w0.203: PB.15 54.74,3.68 48.64,3.68 v2(44.96,7.37) 43.81,8.51 43.81,13.33 42.9,14.25 U1.6
  Bottom Layer w0.203: TF.5 48.38,15.36 46.86,13.84 46.86,9.27 v2(44.96,7.37)
PB2: length 43
  Top Layer w0.203: PB.14 52.58,3.3 48.01,3.3 v2(44.07,7.24) 43.43,7.87 43.43,13.08 42.67,13.84 40.92,13.84
  Bottom Layer w0.203: R23.1 53.09,20.19 50.46,17.56 TF.7 48.42,17.56 46.48,15.62 46.48,9.65 v2(44.07,7.24)
PB3: length 40.4
  Top Layer w0.203: PB.13 50.42,2.92 47.37,2.92 43.05,7.24 43.05,12.83 42.44,13.44 U1.4
  Bottom Layer w0.203: R24.1 51.56,19.81 50.41,18.66 TF.8 48.38,18.66 46.1,16.38 46.1,10.03 v2(43.18,7.11)
PB4: length 42
  Top Layer w0.203: PB.12 48.26,2.54 46.74,2.54 v2(44.58,4.7) 42.67,6.6 42.67,12.57 42.22,13.03 U1.3
  Bottom Layer w0.203: v2(44.58,4.7) 49.06,9.18 TF.1 50.46,10.96 57.91,18.42 R20.1
PB5: length 39.8
  Top Layer w0.203: U1.2 41.96,12.65 42.29,12.32 42.29,5.97 v2(43.69,4.57) PB.11
  Bottom Layer w0.203: v2(43.69,4.57) 47.62,8.51 47.62,11.3 48.38,12.06 TF.2 50.42,12.06 56.39,18.03 R21.1
PB6: length 12.4
  Top Layer w0.203: PB.10 40.92,4.8 U1.1
PB7: length 10.7
  Top Layer w0.203: PB.9 39.83,3.35 U1.64
PB8: length 9.9
  Top Layer w0.203: PB.8 39.42,1.32 39.42,11.15
PB9: length 10.8
  Top Layer w0.203: U1.62 39.04,3.48 PB.7
PB10: length 11.7
  Top Layer w0.203: U1.61 38.63,5.61 PB.6
PB11: length 12.6
  Top Layer w0.203: U1.60 38.23,7.75 PB.5
PB12: length 13
  Top Layer w0.203: U1.56 36.63,8.69 PB.4
PB13: length 15
  Top Layer w0.203: PB.3 27.94,2.54 29.84,2.54 36.22,8.92 U1.55
PB14: length 17
  Top Layer w0.203: U1.54 35.84,9.17 29.59,2.92 25.78,2.92 PB.2
PB15: length 19
  Top Layer w0.203: 35.43,11.15 35.43,9.4 29.34,3.3 23.62,3.3 PB.1
PC0: length 14.2
  Top Layer w0.203: v2(28.32,19.69) U2.5 ; U1.40 29.13,15.44 v2(24.89,19.69)
  Bottom Layer w0.203: v2(24.89,19.69) v2(28.32,19.69)
PC1: length 13
  Top Layer w0.203: U1.39 29.74,15.85 23.37,22.22 22.38,22.22
PC2: length 13.3
  Top Layer w0.203: v2(27.81,20.95) U2.6 ; U1.38 30.12,16.23 v2(25.4,20.95)
  Bottom Layer w0.203: v2(25.4,20.95) v2(27.81,20.95)
PC3: length 13.2
  Top Layer w0.203: U1.37 30.48,16.64 23.62,23.5 U2.1
PC4: length 7.7
  Top Layer w0.203: U1.36 31.47,17.04 30.99,17.53 30.99,21.34 30.1,22.22 29.44,22.22
PC5: length 13.7
  Top Layer w0.203: v2(31.62,20.32) 31.37,20.07 31.37,17.65 31.57,17.45 U1.35 ; U2.3 23.37,20.95 v2(24,20.32)
  Bottom Layer w0.203: v2(31.62,20.32) v2(24,20.32)
PC6: length 35
  Top Layer w0.203: U1.19 39.04,25.58 v2(39.24,25.78) ; v2(11.94,24.13) R4.2
  Bottom Layer w0.203: v2(11.94,24.13) 13.59,25.78 v2(39.24,25.78)
PC7: length 35.4
  Top Layer w0.203: v2(11.94,22.35) R5.2 ; 39.42,19.33 39.42,24.82 v2(39.75,25.15)
  Bottom Layer w0.203: v2(11.94,22.35) 14.73,25.15 v2(39.75,25.15)
PC14: length 42.7
  Top Layer w0.203: v2(48.9,7.62) 54.46,7.62 BTN2.3 BTN2.4 ; v2(29.08,3.94) 29.34,3.94 35.03,9.63 U1.52
  Bottom Layer w0.203: v2(29.08,3.94) 45.21,3.94 v2(48.9,7.62)
PF6: length 23.6
  Top Layer w0.203: BTN1.4 BTN1.3 53.31,11.94 45.09,11.94 44.7,12.32 44.7,15.11 43.18,16.64 U1.12
U0_5V: length 9.1
  Top Layer w0.508: USB0.B4A9 9.03,4.58 v1(9.4,4.95) ; USB0.A4B9 9.03,9.39 v1(9.4,9.02)
  Bottom Layer w0.508: v1(9.4,4.95) v1(9.4,9.02) D0.2
U0_RST: length 7
  Top Layer w0.203: U0.4 14.94,9.19 15.49,8.64 R15.1 C15.2
U0_SWC: length 5.1
  Top Layer w0.203: 16.9,4.75 16.9,3.56 14.6,1.27 DBG.2
U0_SWD: length 6.9
  Top Layer w0.203: 16.25,4.75 16.25,3.67 15.11,2.54 12.7,2.54 DBG.1
U1_5V: length 41.3
  Top Layer w0.203: v1(9.4,25.53) 9.91,25.02 17.78,25.02 20.7,22.1 20.7,14.86 21.31,14.25 U1.43
  Top Layer w0.508: v1(9.4,21.46) 9.03,21.09 USB1.B4A9 ; v1(9.4,25.53) 9.03,25.89 USB1.A4B9
  Bottom Layer w0.508: v1(9.4,25.53) v1(9.4,21.46) D1.2
U1_RST: length 60.6
  Top Layer w0.203: v2(40,23.24) 54.08,23.24 RST.3 RST.4 ; U0.10 11.04,11.68 12.83,13.46 R9.1 v2(13.97,13.46) 14.92,13.46 ; 33.83,19.33 32.79,19.33 v2(32.77,19.3)
  Bottom Layer w0.203: v2(13.97,13.46) 13.97,16.26 16.76,19.05 32.51,19.05 v2(32.77,19.3) 32.77,21.21 34.8,23.24 v2(40,23.24)
U1_SWC: length 29.2
  Top Layer w0.203: v2(18.41,17.78) 18.41,12.83 17.53,11.94 13.59,11.94 13,11.34 U0.7 ; 32.74,17.83 v2(34.14,17.83)
  Bottom Layer w0.203: v2(34.14,17.83) 18.47,17.83 v2(18.41,17.78)
U1_SWD: length 26.4
  Top Layer w0.203: U1.33 32.56,18.42 v2(32.51,18.42) ; U0.6 13.65,11.23 13.97,11.56 17.78,11.56 19.05,12.83 v2(19.05,18.42)
  Bottom Layer w0.203: v2(32.51,18.42) v2(19.05,18.42)
U1_XIN: length 6.9
  Top Layer w0.203: Y12M.1 45.72,20.04 C10.1 45.71,18.24 U1.16
U1_XOUT: length 12.8
  Top Layer w0.203: 47.22,21.08 46.99,20.86 46.99,19.5 C11.2 ; 47.22,21.08 41.58,21.08 U1.17 ; 47.22,21.08 Y12M.3
USB0_D+: length 13.6
  Top Layer w0.203: U0.18 15.59,6.38 14.74,7.23 USB0.A6 6.47,7.23 6.22,6.98 6.22,6.48 6.47,6.23 USB0.B6
USB0_D-: length 12.6
  Top Layer w0.203: USB0.A7 14.47,6.73 14.94,6.26 U0.17 ; v2(8.64,6.35) 8.64,6.73 ; USB0.B7 8.5,7.73 v2(8.64,7.87)
  Bottom Layer w0.203: v2(8.64,7.87) v2(8.64,6.35)
USB1_D+: length 35.6
  Top Layer w0.203: USB1.A6 6.35,23.75 6.1,23.5 6.1,22.99 6.34,22.75 USB1.B6 9.26,22.75 10.54,21.46 17.78,21.46 19.69,19.56 19.69,14.61 21.26,13.03 U1.46
USB1_D-: length 35.5
  Top Layer w0.203: 32.74,13.84 21.08,13.84 20.19,14.73 20.19,21.84 18.8,23.24 17.78,23.24 17.78,23.25 USB1.A7 ; USB1.B7 8.52,24.25 8.76,24 8.76,23.25
X32_IN: length 8
  Top Layer w0.203: C12.1 45.72,14.73 Y32K.1 45.72,14.74 43,17.45 U1.14
X32_OUT: length 10.7
  Top Layer w0.203: C13.2 48.26,14.73 48.26,14.73 47,16 45.09,16 43.26,17.83 40.92,17.83
$1N5592: length 9.7
  Top Layer w0.203: R11.1 4.32,1.53 4.32,6.73 5.82,8.23 USB0.A5
$1N5593: length 6
  Top Layer w0.203: USB0.B5 5.87,5.23 5.34,4.71 R10.1
$1N5603: length 1.9
  Top Layer w0.508: R0.1 14.82,15.24 PWR.2
$1N5607: length 6.5
  Top Layer w0.203: R13.1 5.34,25.26 5.86,24.75 USB1.A5
$1N5608: length 10.2
  Top Layer w0.203: USB1.B5 5.81,21.75 4.32,23.24 4.32,28.95 R12.1
$1N5816: length 4.8
  Top Layer w0.203: U0.1 17.71,11.05 20.06,11.05 R14.2
$1N15618: length 8
  Top Layer w0.203: C7.1 34.04,9.91 34.24,10.11 U1.50
$1N16226: length 3
  Top Layer w0.203: C6.1 37.03,21.77 37.03,19.33
$1N17258: length 1.9
  Top Layer w0.508: R2.1 14.82,20.57 URX.2
$1N17260: length 1.9
  Top Layer w0.508: SWD.2 14.82,17.02 R1.1
$1N17262: length 1.9
  Top Layer w0.508: R3.1 14.82,18.8 UTX.2
$1N17268: length 1.9
  Top Layer w0.508: LED1.2 14.82,24.13 R4.1
$1N17271: length 1.9
  Top Layer w0.508: LED2.2 14.82,22.35 R5.1
$1N30043: length 5.6
  Top Layer w0.203: C8.1 27.83,12.65 U1.47
$1N30366: length 5.3
  Top Layer w0.203: R8.1 27.5,15.04 U1.41
$1N62267: length 4.4
  Bottom Layer w0.508: D1.1 D0.1

## Text on the board
Bottom Silkscreen Layer: PA0 => UART_RXD / PA1 => UART_TXD / PB0 => SDIO_CMD / PB1 => SDIO_CLK / PB2 => SDIO_D0 / PB3 => SDIO_D1 / PB4 => SDIO_D2 / PB5 => SDIO_D3
Top Silkscreen Layer: D | C | G | PC7 | PC6 | 3V3 | A0 | 15 | 14 | 1 | 13 | 2 | 12 | 3 | 11 | 4 | 10 | 5 | 6 | 9 | 7 | 8 | PC14 | PF6 | GND | B0 | 5V | M484SID v3
